# EAGLE design RCShield-v2 (EAGLE 6.3)
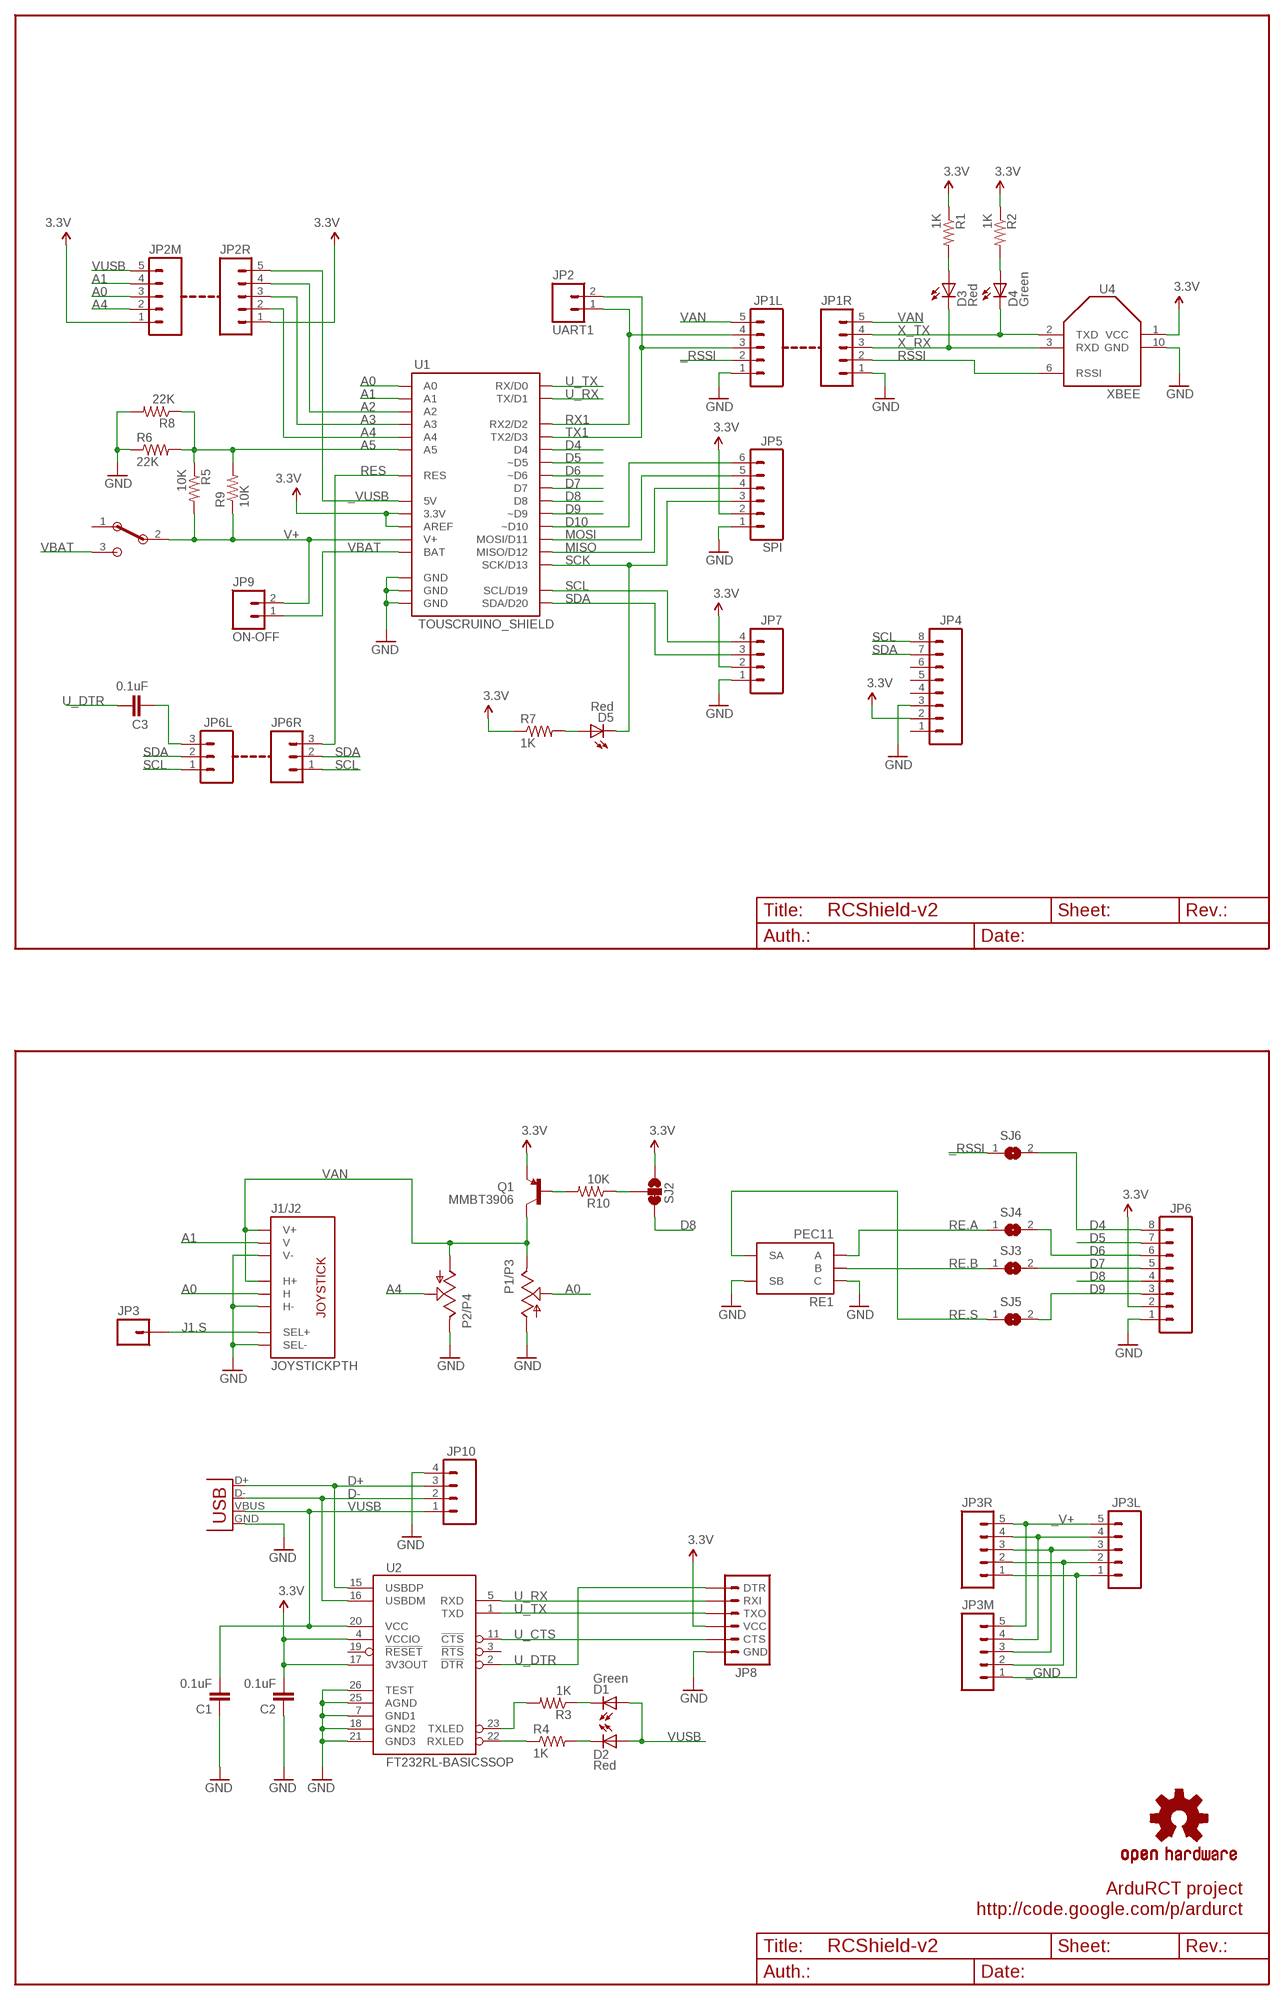
[diagram p0: schematic, sheet 1]

## Parts
C1  0.1uF  CAP0805  [0805]
C2  0.1uF  CAP0805  [0805]
C3  0.1uF  CAP0805  [0805]
D1  Green  LED  [LED]
D2  Red  LED  [LED]
D3  Red  LED  [LED]
D4  Green  LED  [LED]
D5  Red  LED  [LED]
J1/J2  JOYSTICKPTH  [JOYSTICK]
JP1L  M05  [2+3]
JP1R  M05  [2+3]
JP2  UART1  M02  [1X02]
JP2M  M05  [2+3]
JP2R  M05  [2+3]
JP3  M01PTH  [1X01]
JP3L  M05  [2+3]
JP3M  M05  [2+3]
JP3R  M05  [2+3]
JP4  M08  [1X08]
JP5  SPI  M06SIP  [1X06]
JP6  M08  [1X08]
JP6L  M03PTH  [1X03]
JP6R  M03PTH  [1X03]
JP7  M04  [1X04]
JP8  ARDUINO_SERIAL_PROGRAM  [1X06_F]
JP9  ON-OFF  M02  [1X02]
JP10  M04  [1X04]
P1/P3  POT  [ALPS_POT]
P2/P4  POT  [ALPS_POT]
Q1  MMBT3906  TRANSISTOR_PNPSMD  [SOT23-3]
R1  1K  RESISTOR0805-RES  [0805]
R2  1K  RESISTOR0805-RES  [0805]
R3  1K  RESISTOR0805-RES  [0805]
R4  1K  RESISTOR0805-RES  [0805]
R5  10K  RESISTOR0805-RES  [0805]
R6  22K  RESISTOR0805-RES  [0805]
R7  1K  RESISTOR0805-RES  [0805]
R8  22K  R-US_0207/7  [0207/7]
R9  10K  R-US_0207/7  [0207/7]
R10  10K  RESISTOR0805-RES  [0805]
RE1  PEC11  [PEC11]
S4  EG1224  [EG1224]
SJ2  SJ_2WAYS_1-2W  [SJ_2WAYS_1-2]
SJ3  SJ  [SJ]
SJ4  SJ  [SJ]
SJ5  SJ  [SJ]
SJ6  SJ  [SJ]
U1  TOUSCRUINO_SHIELD  TOUSCRUINO_SHIELDSPLIT  [TOUSCRUINO_SHIELD_SPLIT]
U2  FT232RL-BASICSSOP  [SSOP28DB]
U4  XBEE  XBEE-RSSI  [XBEE-SMD]
U$1  OSHW-LOGOM  [OSHW-LOGO-M]
X1  USBSMD  [USB-MINIB]

## Nets
3.3V: C2.2 JP2M.1 JP2R.1 JP4.2 JP5.2 JP6.2 JP7.2 JP8.4(VCC) Q1.2(E) R1.1 R2.1 R7.1 SJ2.3 U1.3.3V U1.AREF U2.4(VCCIO) U2.17(3V3OUT) U4.1(VCC)
_GND [vcc]: JP3L.1 JP3M.1 JP3R.1
_RSSI: JP1L.2 SJ6.1
_V+: JP3L.5 JP3M.5 JP3R.5
_VUSB: JP2R.5 U1.5V
A0: J1/J2.H2(H) JP2M.3 P1/P3.P$2(S) U1.A0
A1: J1/J2.V2(V) JP2M.4 U1.A1
A2: JP2R.4 U1.A2
A3: JP2R.3 U1.A3
A4: JP2M.2 JP2R.2 P2/P4.P$2(S) U1.A4
A5: R5.1 R6.2 R8.1 R9.2 U1.A5
D4: JP6.8 SJ6.2 U1.D4
D5: JP6.7 U1.D5(~D5)
D6: JP6.6 SJ4.2 U1.D6(~D6)
D7: JP6.5 SJ3.2 U1.D7
D8: JP6.4 SJ2.1 U1.D8
D9: JP6.3 SJ5.2 U1.D9(~D9)
D10: JP5.6 U1.D10(~D10)
D+: JP10.3 U2.15(USBDP) X1.D+
D-: JP10.2 U2.16(USBDM) X1.D-
GND [vcc]: C1.1 C2.1 J1/J2.B2A(SEL-) J1/J2.H3(H-) J1/J2.V3(V-) JP1L.1 JP1R.1 JP4.3 JP5.1 JP6.1 JP7.1 JP8.6(GND) JP10.4 P1/P3.P$3(A) P2/P4.P$1(E) R6.1 R8.2 RE1.C RE1.S2(SB) U1.GND@0(GND) U1.GND@1(GND) U1.GND@2(GND) U2.7(GND1) U2.18(GND2) U2.21(GND3) U2.25(AGND) U2.26(TEST) U4.10(GND) X1.GND
J1.S: J1/J2.B1A(SEL+) JP3.1
MISO: JP5.4 U1.D12(MISO/D12)
MOSI: JP5.5 U1.D11(MOSI/D11)
N$1: C3.2 JP6L.3
N$2: Q1.1(B) R10.2
N$3: R10.1 SJ2.2
N$4: JP3L.4 JP3M.4 JP3R.4
N$5: JP3L.3 JP3M.3 JP3R.3
N$6: JP3L.2 JP3M.2 JP3R.2
N$8: D5.A1(A) R7.2
N$14: D3.A1(A) R1.2
N$18: R3.2 U2.23(TXLED)
N$22: R4.1 U2.22(RXLED)
N$25: D4.A1(A) R2.2
RE.A: RE1.A SJ4.1
RE.B: RE1.B SJ3.1
RE.S: RE1.S1(SA) SJ5.1
RES: JP6R.3 U1.RES
RSSI: JP1R.2 U4.6(RSSI)
RX1: JP1L.4 JP2.1 U1.D2(RX2/D2)
SCK: D5.C1(C) JP5.3 U1.D13(SCK/D13)
SCL: JP4.8 JP6L.1 JP6R.1 JP7.4 U1.SCL(SCL/D19)
SDA: JP4.7 JP6L.2 JP6R.2 JP7.3 U1.SDA(SDA/D20)
TX1: JP1L.3 JP2.2 U1.D3(TX2/D3)
U_CTS: JP8.5(CTS) U2.11(!CTS)
U_DTR: C3.1 JP8.1(DTR) U2.2(!DTR)
U_RX: JP8.2(RXI) U1.TX(TX/D1) U2.5(RXD)
U_RX_LED: D2.C1(C) R4.2
U_TX: JP8.3(TXO) U1.RX(RX/D0) U2.1(TXD)
U_TX_LED: D1.C1(C) R3.1
V+: JP9.2 R5.2 R9.1 S4.2 U1.V+
VAN: J1/J2.H1(H+) J1/J2.V1(V+) JP1L.5 JP1R.5 P1/P3.P$1(E) P2/P4.P$3(A) Q1.3(C)
VBAT: JP9.1 S4.3 U1.BAT
VUSB: C1.2 D1.A1(A) D2.A1(A) JP2M.5 JP10.1 U2.20(VCC) X1.VBUS
X_RX: D3.C1(C) JP1R.3 U4.3(RXD)
X_TX: D4.C1(C) JP1R.4 U4.2(TXD)
Unconnected: JP4.1 JP4.4 JP4.5 JP4.6 S4.1 U2.3(!RTS) U2.19(!RESET)

## Notes on the sheet
- ArduRCT project
- http://code.google.com/p/ardurct

## Library data of the parts
C1-C3 = SparkFun:CAP: Capacitor Standard 0603 ceramic capacitor, and 0.1" leaded capacitor.
D1-D5 = wibauxl:LED
J1/J2 = SparkFun:JOYSTICK: Thumb Joystick Joystick commonly found in PS2 controllers. Two pots and a select switch. Footprint proven. Spark Fun Electronics SKU : COM-09032
JP1L JP1R JP2M JP2R JP3L JP3M JP3R = wibauxl:M05
JP2 JP9 = wibauxl:M02
JP3 = SparkFun:M01: Header 1 Standard 1-pin 0.1" header. Use with straight break away headers (SKU : PRT-00116), right angle break away headers (PRT-00553), swiss pins (PRT-00743), machine pins (PRT-00117), and female headers (PRT-00115).
JP4 JP6 = wibauxl:M08
JP5 = SparkFun:M06: Header 6 Standard 6-pin 0.1" header. Use with straight break away headers (SKU : PRT-00116), right angle break away headers (PRT-00553), swiss pins (PRT-00743), machine pins (PRT-00117), and female headers (PRT-00115). Molex polarized connector foot print use with SKU : PRT-08094 with associated crimp pins and housings. NOTES ON THE VARIANTS LOCK and LOCK_LONGPADS... This footprint was designed to help hold the alignment of a through-hole component (i.e. 6-pin header) while soldering it into place. You may notice that each hole has been shifted either up or down by 0.005 of an inch from it's more standard position (which is a perfectly straight line). This slight alteration caused the pins (the squares in the middle) to touch the edges of the holes. Because they are alternating, it causes a "brace" to hold the component in place. 0.005 has proven to be the perfect amount of "off-center" position when using our standard breakaway headers. Although looks a little odd when you look at the bare footprint, once you have a header in there, the alteration is very hard to notice. Also, if you push a header all the way into place, it is covered up entirely on the bottom side. This idea of altering the position of holes to aid alignment will be further integrated into the Sparkfun Library for other footprints. It can help hold any component with 3 or more connection pins.
JP6L JP6R = SparkFun:M03: Header 3 Standard 3-pin 0.1" header. Use with straight break away headers (SKU : PRT-00116), right angle break away headers (PRT-00553), swiss pins (PRT-00743), machine pins (PRT-00117), and female headers (PRT-00115). Molex polarized connector foot print use with SKU : PRT-08232 with associated crimp pins and housings.
JP7 JP10 = wibauxl:M04
JP8 = wibauxl:ARDUINO_SERIAL_PROGRAM
P1/P3 P2/P4 = wibauxl:POT
Q1 = wibauxl:TRANSISTOR_PNP: Such as the MMBT3906
R1-R7 R10 = SparkFun:RESISTOR: Resistor Basic schematic elements and footprints for 0603, 1206, and PTH resistors.
R8 R9 = resistor:R-US_: RESISTOR, American symbol
RE1 = wibauxl:PEC11
S4 = wibauxl:EG1224
SJ2 = wibauxl:SJ_2WAYS_1-2
SJ3-SJ6 = jumper:SJ: SMD solder JUMPER
U1 = wibauxl:TOUSCRUINO_SHIELD
U2 = wibauxl:FT232RL-BASIC: USB UART This is the simplified version of the FT232RL unit. Only what you need, nothing you don't. Spark Fun Electronics SKU : COM-00650
U4 = wibauxl:XBEE-RSSI
U$1 = SparkFun:OSHW-LOGO: Open Source Hardware Logo This logo indicates the piece of hardware it is found on incorporates a OSHW license and/or adheres to the definition of open source hardware found here: http://freedomdefined.org/OSHW
X1 = SparkFun:USB: USB Connectors USB-B-PTH is fully proven SKU : PRT-00139 USB-miniB is fully proven SKU : PRT-00587 USB-A-PCB is untested. USB-A-H is throughly reviewed, but untested. Spark Fun Electronics SKU : PRT-00437 USB-B-SMT is throughly reviewed, but untested. Needs silkscreen touching up. USB-A-S has not been used/tested USB-MB-H has not been used/tested

## Net classes
0 default: width 0.203 mm
1 vcc: width 0.254 mm

## Board
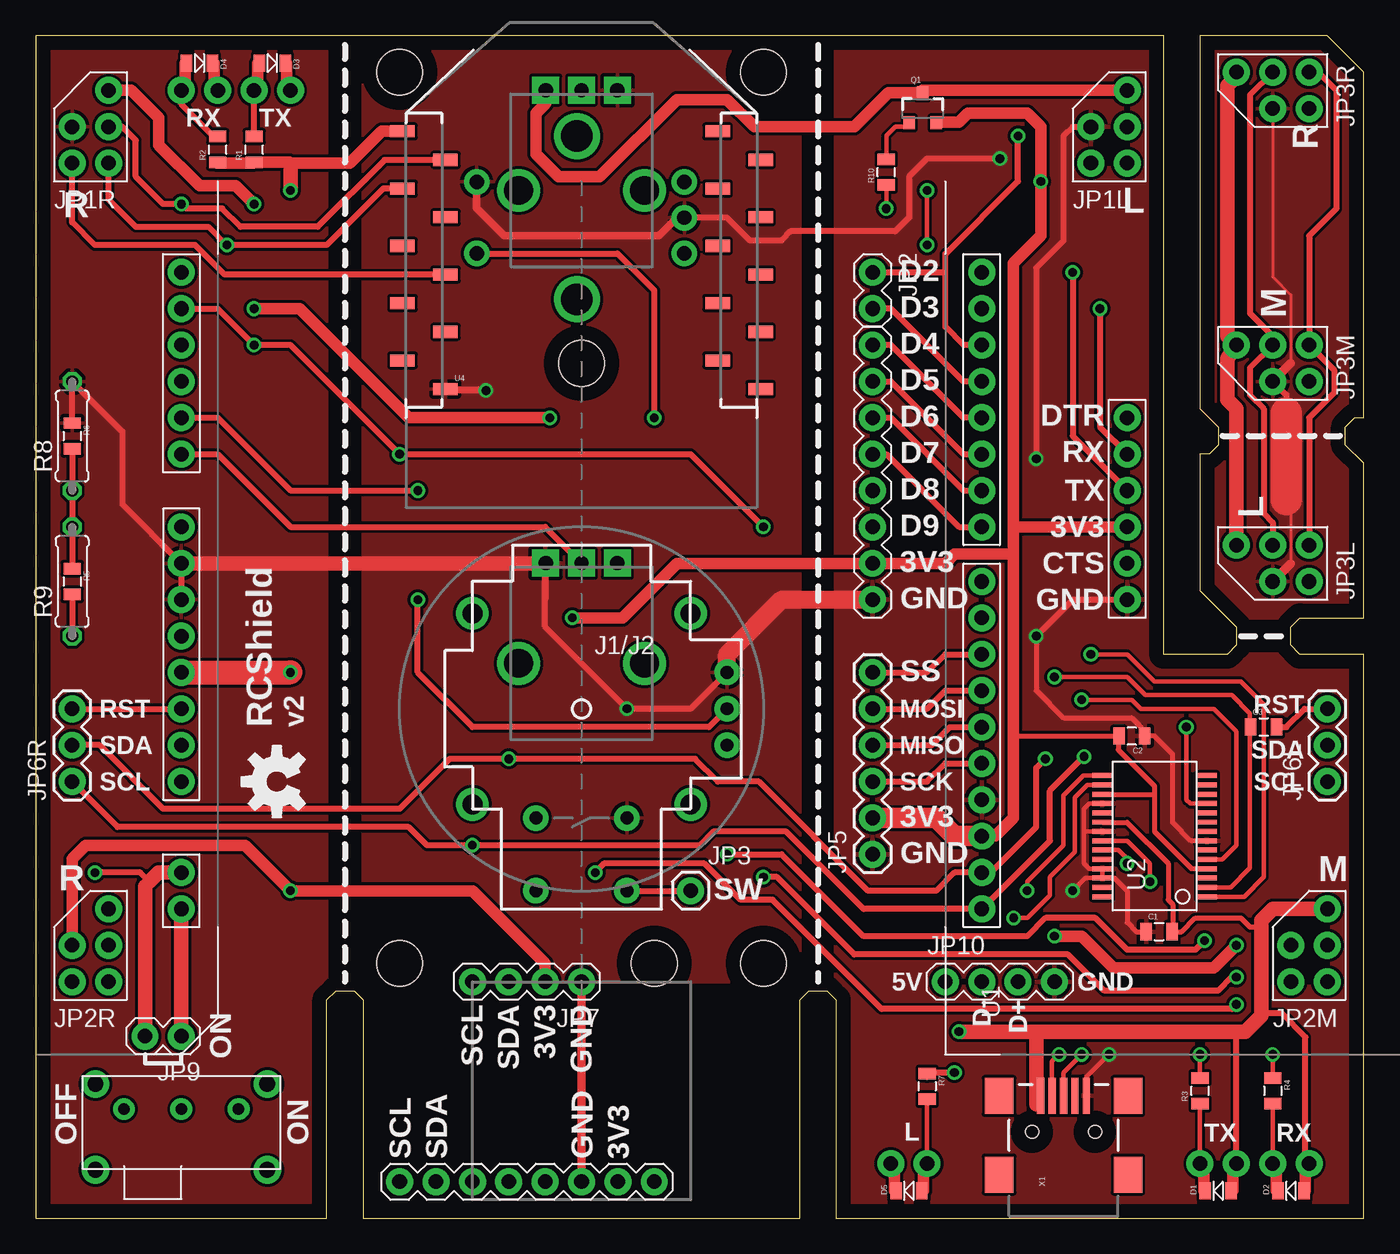
[diagram p1: board, top side]
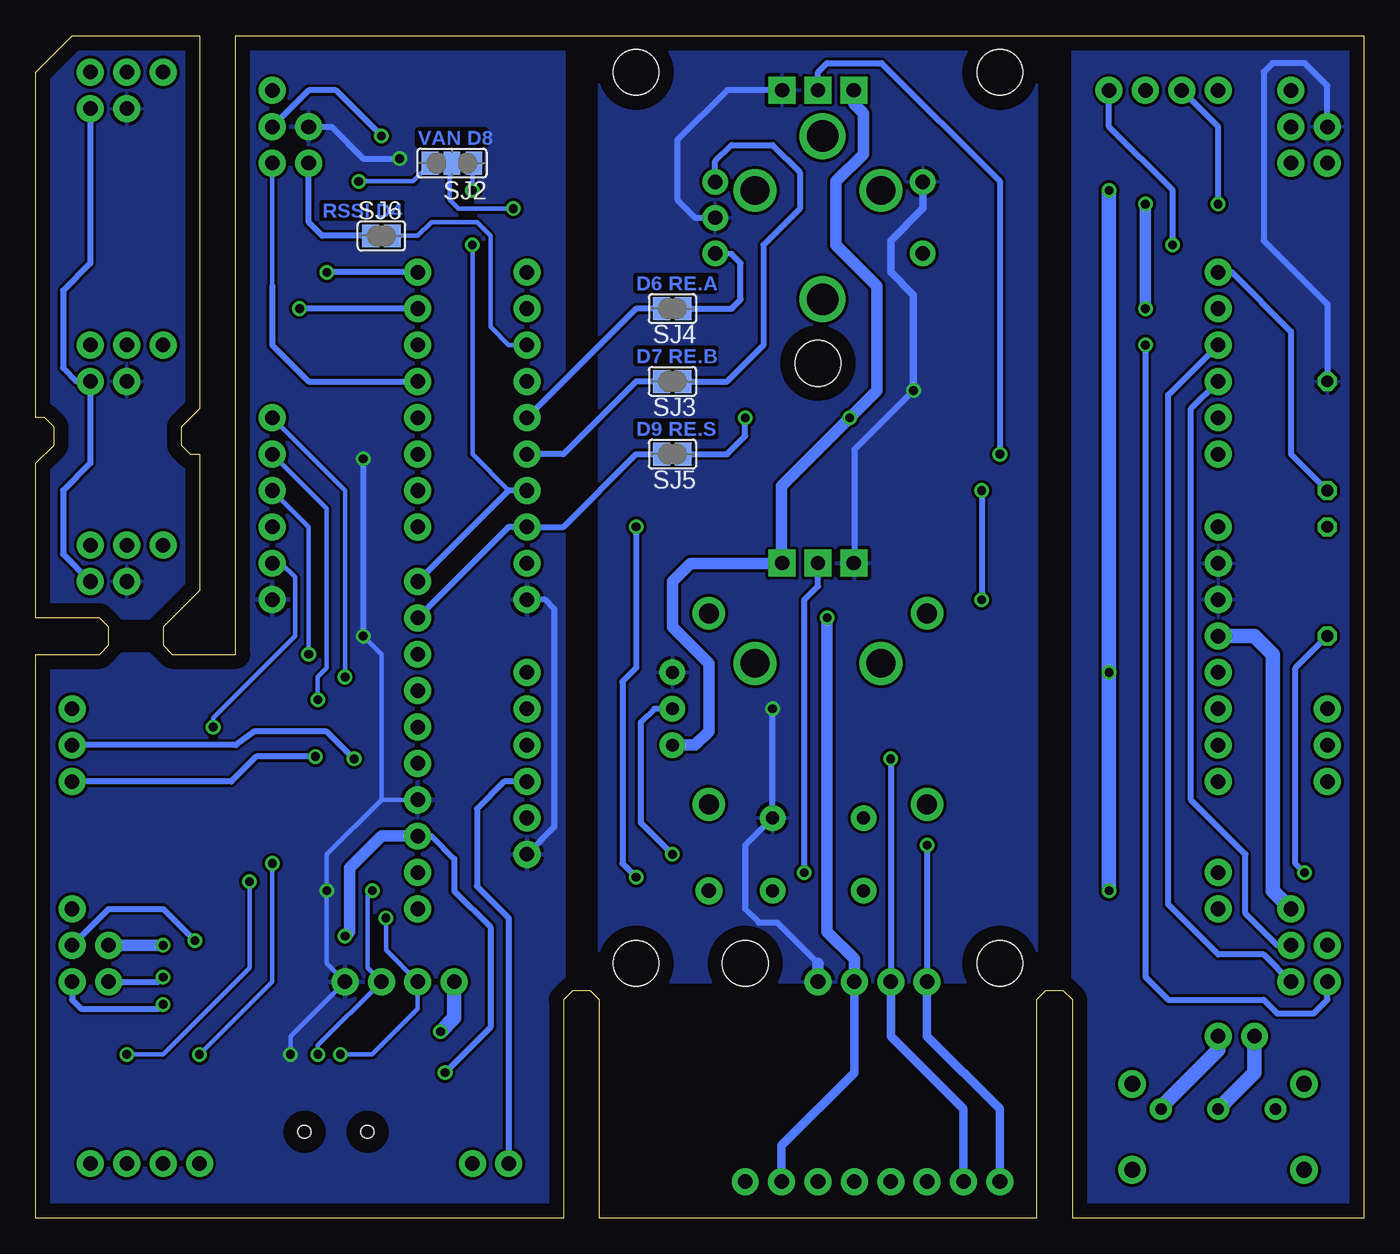
[diagram p2: board, bottom side, seen from below]

Size 92.71 x 82.55 mm. Coordinates in mm from the lower left corner, seen from the top.
Outline: 0,0 20.32,0 20.32,15.24 20.95,15.88 22.23,15.88 22.86,15.24 22.86,0 53.34,0 53.34,15.24 53.98,15.88 55.24,15.88 55.88,15.24 55.88,0 92.71,0 92.71,39.37 88.27,39.37 87.63,40.01 87.63,41.27 88.27,41.91 92.71,41.91 92.71,52.7 91.44,53.98 91.44,55.24 92.08,55.88 92.71,55.88 92.71,80.01 90.17,82.55 81.28,82.55 81.28,56.52 82.55,55.24 82.55,53.98 81.92,53.34 81.28,53.34 81.28,43.81 83.82,41.27 83.82,40.01 83.19,39.37 78.74,39.37 78.74,82.55 0,82.55 0,0
Copper layers (1*16): Top 0.035mm / dielectric 1.5mm / Bottom 0.035mm
Design rules "default *": minimum track width 10mil, minimum drill 24mil, track to track 8mil, track to pad 8mil, pad to pad 8mil, via to via 8mil, smd to smd 8mil, copper to edge 40mil, drill to drill 8mil, minimum pad ring 10mil, minimum via ring 8mil, stop-mask expansion 4mil, vias tented up to drill 0mil, thermal gap 10mil
Holes 3.2 mm at 50.8,17.78 25.4,17.78 25.4,80.01 50.8,80.01 38.1,59.69 43.18,17.78

### Footprints (pad centres in the part's own frame; a part is rotated, then mirrored left to right if it is on the bottom)
0805 = smd 0.8 x 1.2: 1 -0.9,0; 2 0.9,0
LED = smd 0.8 x 1.2: A -0.9,0; C 0.9,0 | drill 1.016 pad 1.88: A1 -1.27,-1.905; C1 1.27,-1.905
JOYSTICK = drill 0.9 pad 1.778: B1A -3.175,12.7; B1B 3.175,12.7; B2A -3.175,7.62; B2B 3.175,7.62 | drill 0.889 pad 1.778: H1 -2.54,-10.16; H2 0,-10.16; H3 2.54,-10.16; V1 -10.16,2.54; V2 -10.16,0; V3 -10.16,-2.54 | drill 1.397 pad 2.286: MOUNT1 -7.62,6.668; MOUNT2 -7.62,-6.668; MOUNT3 7.62,-6.668; MOUNT4 7.62,6.668
2+3 = drill 1.016 pad 1.88: 1 -1.27,0; 2 1.27,0; 3 1.27,2.54; 4 -1.27,2.54; 5 -3.81,2.54
1X02 = drill 1.016 pad 1.88: 1 0,0; 2 2.54,0
1X01 = drill 1.016 pad 1.88: 1 0,0
1X08 = drill 1.016 pad 1.88: 1 0,0; 2 2.54,0; 3 5.08,0; 4 7.62,0; 5 10.16,0; 6 12.7,0; 7 15.24,0; 8 17.78,0
1X06 = drill 1.016 pad 1.88: 1 0,0; 2 2.54,0; 3 5.08,0; 4 7.62,0; 5 10.16,0; 6 12.7,0
1X03 = drill 1.016 pad 1.88: 1 0,0; 2 2.54,0; 3 5.08,0
1X04 = drill 1.016 pad 1.88: 1 0,0; 2 2.54,0; 3 5.08,0; 4 7.62,0
1X06_F = drill 1.016 pad 1.88: 1 0,0; 2 2.54,0; 3 5.08,0; 4 7.62,0; 5 10.16,0; 6 12.7,0
ALPS_POT = drill 1 pad 1.88 square: P$1 7,-2.5; P$2 7,0; P$3 7,2.5 | drill 2: P$4 0,-4.4; P$5 0,4.4
SOT23-3 = smd 0.8 x 0.9: 1 -0.95,-1; 2 0.95,-1; 3 0,1.1
0207/7 = drill 0.813 octagon: 1 -3.81,0; 2 3.81,0
PEC11 = drill 1 pad 1.778: A -2.5,-7.5; B 2.5,-7.5; C 0,-7.5; S1 -2.5,7; S2 2.5,7 | drill 2.2: SH1 -5.7,0; SH2 5.7,0
EG1224 = drill 0.8 pad 1.524: 1 -4,0; 2 0,0; 3 4,0 | drill 1.1 pad 1.93: P$4 6,1.75; P$5 -6,1.75; P$6 -6,-4.25; P$7 6,-4.25
SJ_2WAYS_1-2 = smd 1.168 x 1.6: 1 -1.524,0; 2 0,0; 3 1.524,0
SJ = smd 1.168 x 1.6: 1 -0.762,0; 2 0.762,0
TOUSCRUINO_SHIELD_SPLIT = drill 1.016 pad 1.88: 3.3V -27.94,-8.89; 5V -27.94,-6.35; A0 -27.94,6.35; A1 -27.94,8.89; A2 -27.94,11.43; A3 -27.94,13.97; A4 -27.94,16.51; A5 -27.94,19.05; AREF 27.94,-20.32; BAT -27.94,-25.4; D2 27.94,13.97; D3 27.94,11.43; D4 27.94,8.89; D5 27.94,6.35; D6 27.94,3.81; D7 27.94,1.27; D8 27.94,-2.54; D9 27.94,-5.08; D10 27.94,-7.62; D11 27.94,-10.16; D12 27.94,-12.7; D13 27.94,-15.24; GND@0 -27.94,-3.81; GND@1 -27.94,-1.27; GND@2 27.94,-17.78; IOREF -27.94,-13.97; NC -27.94,-16.51; RES -27.94,-11.43; RX 27.94,19.05; SCL 27.94,-25.4; SDA 27.94,-22.86; TX 27.94,16.51; V+ -27.94,-22.86; VIN -27.94,1.27
SSOP28DB = smd 0.348 x 1.397: 1 -4.225,-3.656; 2 -3.575,-3.656; 3 -2.925,-3.656; 4 -2.275,-3.656; 5 -1.625,-3.656; 6 -0.975,-3.656; 7 -0.325,-3.656; 8 0.325,-3.656; 9 0.975,-3.656; 10 1.625,-3.656; 11 2.275,-3.656; 12 2.925,-3.656; 13 3.575,-3.656; 14 4.225,-3.656; 15 4.225,3.656; 16 3.575,3.656; 17 2.925,3.656; 18 2.275,3.656; 19 1.625,3.656; 20 0.975,3.656; 21 0.325,3.656; 22 -0.325,3.656; 23 -0.975,3.656; 24 -1.625,3.656; 25 -2.275,3.656; 26 -2.925,3.656; 27 -3.575,3.656; 28 -4.225,3.656
XBEE-SMD = smd 1.7 x 0.85: 1 -12.5,20; 2 -9.5,18; 3 -12.5,16; 4 -9.5,14; 5 -12.5,12; 6 -9.5,10; 7 -12.5,8; 8 -9.5,6; 9 -12.5,4; 10 -9.5,2; 11 12.5,2; 12 9.5,4; 13 12.5,6; 14 9.5,8; 15 12.5,10; 16 9.5,12; 17 12.5,14; 18 9.5,16; 19 12.5,18; 20 9.5,20
USB-MINIB = smd 2.5 x 0.5: D+ 2.5,0; D- 2.5,0.8; GND 2.5,-1.6; ID 2.5,-0.8; VBUS 2.5,1.6 | smd 2.5 x 2: MTN1 -3,4.5; MTN2 2.5,4.5; MTN3 -3,-4.5; MTN4 2.5,-4.5 | hole 0.9: 0,2.2; 0,-2.2

### Placement (x,y rotation side)
C1  78.42,20 0 top
C2  76.52,33.66 180 top
C3  85.72,34.29 0 top
D1  82.55,1.91 180 top
D2  87.63,1.91 180 top
D3  16.51,80.64 0 top
D4  11.43,80.64 0 top
D5  60.96,1.91 180 top
J1/J2  38.1,35.56 180 top
JP1L  73.66,74.93 270 top
JP1R  2.54,74.93 270 top
JP2  58.42,66.04 270 top
JP2M  87.63,17.78 270 top
JP2R  2.54,17.78 270 top
JP3  45.72,22.86 0 top
JP3L  87.63,44.45 0 top
JP3M  87.63,58.42 0 top
JP3R  87.63,77.47 0 top
JP4  43.18,2.54 180 top
JP5  58.42,25.4 90 top
JP6  58.42,43.18 90 top
JP6L  90.17,30.48 90 top
JP6R  2.54,30.48 90 top
JP7  38.1,16.51 180 top
JP8  76.2,55.88 270 top
JP9  10.16,12.7 180 top
JP10  63.5,16.51 0 top
P1/P3  38.1,38.73 90 top
P2/P4  38.1,71.75 90 top
Q1  61.91,77.47 0 top
R1  15.24,74.61 90 top
R2  12.7,74.61 90 top
R3  81.28,8.89 90 top
R4  86.36,8.89 270 top
R5  2.54,44.45 270 top
R6  2.54,54.61 270 top
R7  62.23,9.21 270 top
R8  2.54,54.61 90 top
R9  2.54,44.45 90 top
R10  59.37,73.03 90 top
RE1  37.78,69.85 90 top
S4  10.16,7.62 0 top
SJ2  63.66,73.66 180 bottom
SJ3  48.26,58.42 180 bottom
SJ4  48.26,63.5 180 bottom
SJ5  48.26,53.34 180 bottom
SJ6  68.58,68.58 0 bottom
U1  38.1,46.99 0 top
U2  78.11,26.67 90 top
U4  38.1,55.88 0 top
U$1  16.83,30.48 90 top
X1  71.75,6.03 90 top

### Tracks (layer width: path | path; a pad name or v marks a point on that pad's centre or on a via)
3.3V  (via drill 0.61)
  Top 0.356: U2.4 80.7,24.39 78.11,26.99 78.11,29.53 | 68.26,33.66 C2.2 75.56,33.92 75.56,32.7 78.11,30.16 78.11,29.53 | U2.17 78.04,29.59 78.11,29.53
  Top 0.406: v64.14,10.16 62.55,10.16 62.23,9.84 R7.1 | U4.1 24.13,75.88 | R2.1 12.7,73.66
  Top 0.813: U1.AREF 66.99,26.67 68.26,27.94 68.26,33.66 68.26,46.35 | JP8.4 68.26,48.26 | 68.26,46.35 64.14,46.35 63.5,45.72 JP6.2 44.77,45.72 40.96,41.91 v37.47,41.91 | 24.13,75.88 21.91,73.66 17.78,73.66 | U4.1 24.13,75.88 | 12.65,73.66 R2.1 | 12.7,73.66 15.19,73.66 R1.1 17.73,73.71 17.78,73.66 | 17.78,73.18 17.78,73.66 | JP2R.1 2.54,25.08 3.49,26.04 14.61,26.04 v17.78,22.86 30.48,22.86 35.56,17.78 JP7.2 | v83.82,19.05 82.23,17.46 75.25,17.46 73.03,19.68 v71.12,19.68 | 68.26,48.26 68.26,66.67 70.17,68.58 v70.17,72.39 70.17,76.2 69.22,77.15 65.09,77.15 64.45,76.52 62.91,76.52 Q1.2 | 68.26,48.26 68.26,46.35
  Top 1.016: 17.78,73.18 v17.78,71.75
  Top 1.422: JP5.2 62.87,27.94 64.14,26.67 U1.AREF
  Top 1.676: U1.3.3V v17.78,38.1
  Bottom 0.305: SJ2.3 65.09,73.66 66.36,72.39 v70.17,72.39
  Bottom 0.406: U1.AREF 65.09,26.67 63.5,25.08 63.5,22.86 60.96,20.32 60.96,13.34 v64.14,10.16
  Bottom 0.61: JP7.2 35.56,10.16 40.64,5.08 JP4.2
  Bottom 0.813: JP2M.1 v83.82,19.05 | v71.12,19.68 70.8,20 70.8,24.45 68.58,26.67 U1.AREF | v37.47,41.91 37.47,20 35.56,18.1 JP7.2
  Bottom 1.016: v17.78,71.75 v17.78,38.1 v17.78,22.86
_GND
  Top 0.203: JP3R.1 86.36,65.72 87.63,64.45 87.63,59.69 | 87.63,49.85 87.63,45.72
  Top 0.305: 87.31,50.16 87.63,49.85
  Top 0.406: JP3M.1 87.31,57.47 87.31,56.2
  Top 0.61: 87.63,59.69 JP3M.1 | 87.63,45.72 JP3L.1
  Top 2.184: 87.31,56.2 87.31,50.16
  pour Bottom: 81.28,82.55 90.17,82.55 92.71,80.01 92.71,41.91 81.28,41.91
  pour Top: 81.28,82.55 90.17,82.55 92.71,80.01 92.71,41.91 81.28,41.91
_RSSI
  Bottom 0.406: SJ6.1 72.71,68.58 73.66,69.53 JP1L.2
_V+
  Top 0.406: JP3R.5 83.82,79.69
  Top 1.016: 83.82,79.69 83.19,79.06 83.19,61.59 JP3M.5 83.19,60.01 83.19,57.15 83.82,56.52 JP3L.5
_VUSB
  Bottom 1.016: JP2R.5 6.35,22.86 6.35,39.37 7.62,40.64 U1.5V
A0  (via drill 0.61)
  Top 0.406: v83.82,14.92 83.5,14.61 59.05,14.61 51.44,22.23 49.21,22.23 46.67,24.77 39.69,24.77 v39.05,24.13 | U1.A0 12.7,53.34 17.78,48.26 35.56,48.26 J1/J2.H2 P1/P3.P$2
  Bottom 0.406: JP2M.3 90.17,15.24 89.53,14.61 84.14,14.61 v83.82,14.92 | v39.05,24.13 39.05,43.18 38.1,44.13 J1/J2.H2 P1/P3.P$2
A1  (via drill 0.61)
  Top 0.406: v81.6,19.37 80.96,18.73 76.2,18.73 73.98,20.95 70.48,20.95 69.22,19.68 57.78,19.68 52.07,25.4 v48.26,25.4 | J1/J2.V2 46.99,34.29 30.48,34.29 26.67,38.1 v26.67,43.18 | U1.A1 12.7,55.88 17.78,50.8 v26.67,50.8
  Bottom 0.406: JP2M.4 87.63,21.59 83.82,21.59 v81.6,19.37 | J1/J2.V2 49.53,35.56 50.48,34.61 50.48,27.62 v48.26,25.4 | v26.67,50.8 v26.67,43.18
A2
  Bottom 0.406: JP2R.4 6.03,19.05 8.26,21.27 8.26,25.4 12.06,29.21 12.06,56.52 U1.A2
A3
  Bottom 0.406: JP2R.3 6.99,18.41 10.16,18.41 13.65,21.91 13.65,57.47 U1.A3
A4  (via drill 0.61)
  Top 0.406: v83.82,16.83 83.5,16.83 82.55,15.88 74.61,15.88 72.07,18.41 57.15,18.41 51.75,23.81 v50.8,23.81 | U1.A4 12.7,63.5 v15.24,60.96 17.78,60.96 v25.4,53.34 45.72,53.34 v50.8,48.26
  Bottom 0.406: v50.8,48.26 50.8,38.42 51.75,37.47 51.75,24.77 v50.8,23.81 | v15.24,60.96 15.24,16.83 13.65,15.24 6.99,15.24 6.03,14.29 3.49,14.29 2.54,15.24 JP2R.2 | P2/P4.P$2 38.1,80.01 37.47,80.64 33.66,80.64 25.4,72.39 v25.4,53.34 | JP2M.2 84.14,16.51 v83.82,16.83
A5
  Top 0.406: R6.2 R8.1 R9.2 R5.1
  Bottom 0.406: U1.A5 9.21,66.04 5.08,61.91 5.08,53.34 R8.1
D4
  Top 0.406: U1.D4 64.77,55.88 59.69,60.96 JP6.8
  Bottom 0.305: JP6.8 59.69,60.96 60.96,62.23 60.96,68.58 61.91,69.53 65.09,69.53 66.04,68.58 SJ6.2
D5
  Top 0.406: JP6.7 59.69,58.42 64.77,53.34 U1.D5
D6
  Top 0.406: JP6.6 59.69,55.88 64.77,50.8 U1.D6
  Bottom 0.406: SJ4.2 50.8,63.5 JP6.6
D7
  Top 0.406: JP6.5 59.37,53.34 64.45,48.26 U1.D7
  Bottom 0.406: SJ3.2 50.8,58.42 55.88,53.34 JP6.5
D8  (via drill 0.61)
  Top 0.305: v62.23,67.94 v62.23,71.75
  Bottom 0.305: 59.69,50.8 62.23,53.34 v62.23,67.94 | v62.23,71.75 62.23,73.31 SJ2.1
  Bottom 0.406: JP6.4 59.69,50.8 U1.D8
D9
  Bottom 0.406: U1.D9 59.69,48.26 JP6.3 55.88,48.26 50.8,53.34 SJ5.2
D10
  Top 0.406: JP5.6 62.23,38.1 63.5,39.37 U1.D10
D+  (via drill 0.61)
  Top 0.305: X1.D+ 71.75,10.16 v73.03,11.43 | U2.15 73.12,30.89 71.75,29.53 71.75,26.04 69.22,23.5 v69.22,22.86
  Bottom 0.305: v73.03,11.43 73.03,12.06 JP10.3 69.53,17.46 69.53,22.54 v69.22,22.86
D-  (via drill 0.61)
  Top 0.305: X1.D- 70.95,10.96 v71.44,11.43 | U2.16 73.42,30.25 72.55,29.37 72.55,25.56 70.8,23.81 70.8,22.54 69.22,20.95 v68.26,20.95
  Bottom 0.305: v68.26,20.95 68.26,18.73 JP10.2 66.04,14.61 69.22,11.43 v71.44,11.43
GND  (via drill 0.61)
  Top 0.305: U2.18 73.55,28.95 73.18,28.57 73.18,26.99 | 73.18,26.99 73.49,26.99 U2.21 73.67,27 73.18,26.99 | 73.18,26.99 73.18,24.77 73.55,24.39 U2.25 U2.26 73.28,23.75 v72.39,22.86 | X1.GND 73.36,9.86 v74.93,11.43
  Top 0.356: 77.47,33.71 77.15,34.29 76.52,34.92 71.75,34.92 69.85,36.83 v69.85,40.64 | 77.47,33.71 C2.1 77.47,33.6 77.47,33.66 | U2.26 75.31,23.75 76.2,22.86 76.2,20.64 76.83,20 C1.1 | U2.7 80.65,26.34 79.38,27.62 79.38,32.38 78.11,33.66 77.47,33.66 | 77.47,33.71 77.47,33.66
  Top 0.406: v69.85,53.02 69.85,66.36 71.75,68.26 71.75,75.56 72.39,76.2 JP1L.1 | v69.85,40.64 72.39,43.18 JP8.6 | v67.31,73.98 62.23,73.98 60.96,72.71 60.96,69.85 60.01,68.9 52.7,68.9 52.07,68.26 49.85,68.26 48.26,69.85 RE1.C 44.77,69.85 | R6.1 R8.2 6.03,54.93 6.03,49.85 U1.GND@1 U1.GND@0 | J1/J2.V3 45.72,35.56 v41.27,35.56 35.56,41.27 35.56,43.23 P1/P3.P$3 35.58,43.2 J1/J2.H3 | v31.43,57.78 28.7,57.78 U4.10 31.34,57.88 v31.43,57.78
  Top 0.508: 44.77,69.85 43.5,68.58 32.7,68.58 30.78,70.5 RE1.S2
  Top 0.61: JP7.1 JP4.3
  Top 1.016: J1/J2.H3 U1.GND@1
  Top 1.27: J1/J2.V3 48.26,39.37 52.07,43.18 JP6.1
  Bottom 0.305: U1.GND@2 68.58,29.21 | 68.58,29.21 72.39,25.4 v72.39,22.86 72.39,17.78 JP10.4 74.93,12.7 v74.93,11.43 | 68.58,29.21 68.58,39.37 v69.85,40.64
  Bottom 0.406: v69.85,53.02 v69.85,40.64 | JP1L.1 72.07,76.2 69.85,73.98 v67.31,73.98 | JP5.1 56.52,27.3 56.52,42.55 57.15,43.18 JP6.1 | JP1R.1 2.54,79.06 4.13,80.64 6.35,80.64 6.99,80.01 6.99,68.26 2.54,63.82 R8.2 | v31.43,57.78 35.56,53.66 J1/J2.H3 | v41.27,35.56 J1/J2.B2A 43.18,26.04 43.18,21.59 42.23,20.64 40.96,20.64 38.1,17.78 | P2/P4.P$1 44.44,78.75 47.94,75.25 47.94,71.12 46.67,69.85 RE1.C
  Bottom 0.508: RE1.S2 30.78,70.5 33.02,68.26 33.02,66.04 31.43,64.45 v31.43,57.78
  Bottom 0.813: 38.1,17.78 JP7.1
  pour Top: 0,82.55 20.32,82.55 20.32,0 0,0
  pour Top: 22.86,82.55 53.34,82.55 53.34,16.51 22.86,16.51
  pour Bottom: 0,82.55 20.32,82.55 20.32,0 0,0
  pour Bottom: 22.86,82.55 53.34,82.55 53.34,16.51 22.86,16.51
  pour Bottom: 55.88,82.55 78.74,82.55 78.74,39.37 92.71,39.37 92.71,0 55.88,0
  pour Top: 55.88,82.55 78.74,82.55 78.74,39.37 92.71,39.37 92.71,0 55.88,0
J1.S
  Top 0.406: J1/J2.B1A JP3.1
MISO
  Top 0.406: JP5.4 62.55,33.02 63.82,34.29 U1.D12
MOSI
  Top 0.406: JP5.5 62.23,35.56 63.5,36.83 U1.D11
N$1
  Top 0.406: C3.2 87.31,34.29 88.58,35.56 JP6L.3
N$2
  Top 0.305: R10.2 59.37,75.56 60.01,76.2 60.69,76.2 Q1.1
N$3  (via drill 0.61)
  Top 0.305: v59.37,70.48 R10.1
  Bottom 0.305: SJ2.2 63.85,73.63 63.82,73.03 63.82,71.12 63.18,70.48 v59.37,70.48
N$4
  Top 0.406: JP3R.4 84.77,78.42 84.77,63.18 86.36,61.59 JP3M.4 84.77,59.37 84.77,57.47 85.72,56.52 85.72,49.21 86.36,48.58 JP3L.4
N$5
  Top 0.406: JP3R.3 89.53,80.01 90.81,78.74 90.81,70.48 88.9,68.58 JP3M.3 90.65,59.21 90.65,57.63 88.9,55.88 JP3L.3
N$6
  Bottom 0.406: JP3R.2 88.9,66.67 90.81,64.77 90.81,59.37 89.85,58.42 JP3M.2 88.9,52.7 90.81,50.8 90.81,46.35 JP3L.2
N$8
  Top 0.305: D5.A1 R7.2
N$14
  Top 0.406: R1.2 D3.A1
N$18  (via drill 0.61)
  Top 0.305: U2.23 75.59,25.7 76.2,25.08 v76.2,24.77 | R3.2 v81.28,11.43
  Bottom 0.305: v76.2,24.77 76.2,16.51 v81.28,11.43
N$22  (via drill 0.61)
  Top 0.305: U2.22 76.21,26.34 77.79,24.77 v77.79,23.5 | R4.1 v86.36,11.43
  Bottom 0.305: v77.79,23.5 77.79,17.46 83.82,11.43 v86.36,11.43
N$25
  Top 0.406: R2.2 12.44,75.51 10.16,77.79 D4.A1
RE.A
  Bottom 0.406: SJ4.1 44.13,63.5 43.5,64.14 43.5,66.67 44.13,67.31 RE1.A
RE.B
  Bottom 0.406: SJ3.1 44.45,58.42 41.91,60.96 41.91,67.94 39.37,70.48 39.37,73.03 41.27,74.93 44.13,74.93 45.28,73.78 RE1.B
RE.S  (via drill 0.61)
  Top 0.406: v43.18,55.88 43.18,64.77 40.6,67.35 RE1.S1
  Bottom 0.406: SJ5.1 44.45,53.34 43.18,54.61 v43.18,55.88
RES
  Top 0.406: JP6R.3 U1.RES
RSSI
  Top 0.406: U4.6 13.18,65.88 11.11,67.94 4.13,67.94 2.54,69.53 JP1R.2
RX1  (via drill 0.61)
  Top 0.406: U1.D2 64.77,60.96 63.5,62.23 63.5,66.04 | 63.5,66.04 63.5,67.31 68.58,72.39 v68.58,75.56 | JP2.1 63.5,66.04
  Bottom 0.406: v68.58,75.56 71.75,78.74 73.66,78.74 JP1L.4
SCK
  Top 0.406: JP5.3 62.23,30.48 63.5,31.75 U1.D13
  Bottom 0.406: JP5.3 60.01,30.48 61.91,28.57 61.91,23.18 59.69,20.95 D5.C1
SCL  (via drill 0.61)
  Top 0.406: JP6R.1 5.71,27.3 26.04,27.3 27.3,26.04 v30.48,26.04 46.35,26.04 47.31,26.99 52.39,26.99 57.78,21.59 U1.SCL 70.8,26.35 70.8,29.84 v73.18,32.23
  Bottom 0.406: v30.48,26.04 JP7.4 | v73.18,32.23 77.31,32.23 79.06,30.48 JP6L.1
  Bottom 0.61: JP7.4 30.48,12.7 25.4,7.62 JP4.8
SDA  (via drill 0.61)
  Top 0.406: JP6R.2 4.45,33.02 8.89,28.57 25.4,28.57 28.89,32.07 v33.02,32.07 46.04,32.07 47.62,30.48 50.48,30.48 58.1,22.86 62.87,22.86 64.14,24.13 U1.SDA 66.67,24.13 69.85,27.3 69.85,31.43 v70.48,32.07
  Bottom 0.406: v70.48,32.07 72.39,33.97 77.47,33.97 78.74,33.02 JP6L.2 | v33.02,32.07 JP7.3
  Bottom 0.61: JP7.3 33.02,12.7 27.94,7.62 JP4.7
TX1
  Top 0.406: U1.D3 64.77,58.42 59.69,63.5 JP2.2
  Bottom 0.305: JP1L.3 76.2,65.09
  Bottom 0.406: 76.2,65.09 76.2,60.96 73.66,58.42 U1.D3
U_CTS  (via drill 0.61)
  Top 0.305: U2.11 80.59,28.95 80.33,29.21 v80.33,34.29
  Bottom 0.305: JP8.5 75.56,45.72 74.61,44.77 74.61,40.64 80.33,34.92 v80.33,34.29
U_DTR  (via drill 0.61)
  Top 0.305: U2.2 83.42,23.09 84.77,24.45 84.77,34.29 | C3.1 84.77,34.29 | v71.12,37.78 76.2,37.78 77.47,36.51 83.5,36.51 84.77,35.24 84.77,34.29
  Bottom 0.305: v71.12,37.78 71.12,50.8 JP8.1
U_RX  (via drill 0.61)
  Top 0.305: U2.5 82.83,25.05 83.82,26.04 83.82,33.97 82.23,35.56 77.15,35.56 76.52,36.2 v73.03,36.2
  Top 0.406: v74.3,63.5 74.3,55.24 JP8.2
  Bottom 0.305: v73.03,36.2 73.03,37.78 72.39,38.42 72.39,49.53 JP8.2
  Bottom 0.406: U1.TX v74.3,63.5
U_RX_LED
  Top 0.305: R4.2 D2.C1
U_TX  (via drill 0.61)
  Top 0.305: U2.1 84.36,22.45 85.72,23.81 85.72,35.88 84.14,37.47 78.11,37.47 76.2,39.37 v73.66,39.37
  Top 0.406: v72.39,66.04 72.39,54.61 JP8.3
  Bottom 0.305: JP8.3 73.66,48.26 v73.66,39.37
  Bottom 0.406: U1.RX v72.39,66.04
U_TX_LED
  Top 0.305: R3.1 D1.C1
V+  (via drill 0.61)
  Top 0.406: R5.2 R9.1 | 7.94,23.5 7.3,24.13 v4.13,24.13
  Top 1.016: U1.V+ 8.57,24.13 7.94,23.5 7.62,23.18 JP9.2
  Bottom 0.406: v4.13,24.13 4.76,24.77 4.76,38.42 R9.1
  Bottom 1.016: S4.2 7.62,10.16 JP9.2
VAN  (via drill 0.61)
  Top 0.813: JP1R.5 6.67,78.74 8.57,76.83 8.57,74.93 11.43,72.07 13.97,72.07 v15.24,70.8 | v15.24,63.5 18.41,63.5 26.04,55.88 v35.88,55.88 | P2/P4.P$3 35.58,77.8 34.92,77.15 34.92,74.3 36.51,72.71 39.37,72.71 44.77,78.11 48.26,78.11 50.16,76.2 57.15,76.2 59.52,78.57 Q1.3 62.06,78.57 61.91,78.74 JP1L.5
  Bottom 0.406: 40.6,45.68 P1/P3.P$1
  Bottom 0.508: 40.64,45.46 P1/P3.P$1 40.62,45.4 J1/J2.H1
  Bottom 0.813: P2/P4.P$3 35.58,77.8 34.92,77.15 34.92,74.3 36.83,72.39 36.83,67.94 33.97,65.09 33.97,57.78 v35.88,55.88 40.64,51.12 J1/J2.H1 | J1/J2.H1 40.64,45.46 | v15.24,70.8 v15.24,63.5 | J1/J2.V1 46.67,33.02 45.72,33.97 45.72,38.73 48.26,41.27 48.26,44.45 46.99,45.72 J1/J2.H1
VBAT
  Top 1.016: U1.BAT JP9.1
  Bottom 1.016: S4.3 14.16,7.75 10.16,11.75 JP9.1
VUSB  (via drill 0.61)
  Top 0.305: X1.VBUS 69.89,7.9 69.85,7.94
  Top 0.356: U2.20 76.18,27.64 79.06,24.77 79.06,22.23 79.38,21.91 79.38,20 | 79.38,20 80.01,20 80.96,20.95 84.14,20.95 84.77,20.32 85.41,20.32 85.57,19.37 | 79.38,20 C1.2
  Top 0.406: D1.A1 83.82,13.02 84.45,13.02 | 88.65,3.56 88.65,12.64 87,14.29 85.57,14.29
  Top 1.016: JP2M.5 86.36,21.59 85.57,20.8 85.57,19.37 85.57,14.29 85.57,14.13 84.45,13.02 69.85,13.02 | 69.85,7.94 69.85,13.02 | 69.85,13.02 v64.45,13.02
  Bottom 1.016: v64.45,13.02 63.5,13.97 JP10.1
X_RX  (via drill 0.61)
  Top 0.406: U4.3 24.25,71.88 20.32,67.94 v13.34,67.94 12.06,69.22 6.99,69.22 5.08,71.12 JP1R.3
  Bottom 0.406: v13.34,67.94 13.34,71.75 17.78,76.2 D3.C1
X_TX  (via drill 0.61)
  Top 0.406: U4.2 24.35,73.88 19.68,69.22 14.29,69.22 13.02,70.48 10.48,70.48 v10.16,70.8 8.89,70.8 6.99,72.71 6.99,75.25 6.03,76.2 JP1R.4
  Bottom 0.406: v10.16,70.8 10.16,76.2 D4.C1

### Text on the board
Bottom: VAN D8 | RSSI D4 | D6 RE.A | D7 RE.B | D9 RE.S
tPlace: RX | TX | R | R | L | D2 | D3 | M | D4 | D5 | DTR | D6 | RX | D7 | TX | D8 | 3V3 | L | D9 | CTS | 3V3 | GND | GND | SS | RST | RST | MOSI | RCShield | v2 | SDA | SDA | MISO | SCL | SCL | SCK | 3V3 | GND | R | M | SW | 5V | GND | SCL | SDA | 3V3 | GND | D- | D- | D+ | D+ | ON | OFF | ON | L | TX | RX | SCL | SDA | GND | 3V3